# EAGLE design AudioHacker_v1.2 (EAGLE 6.4)
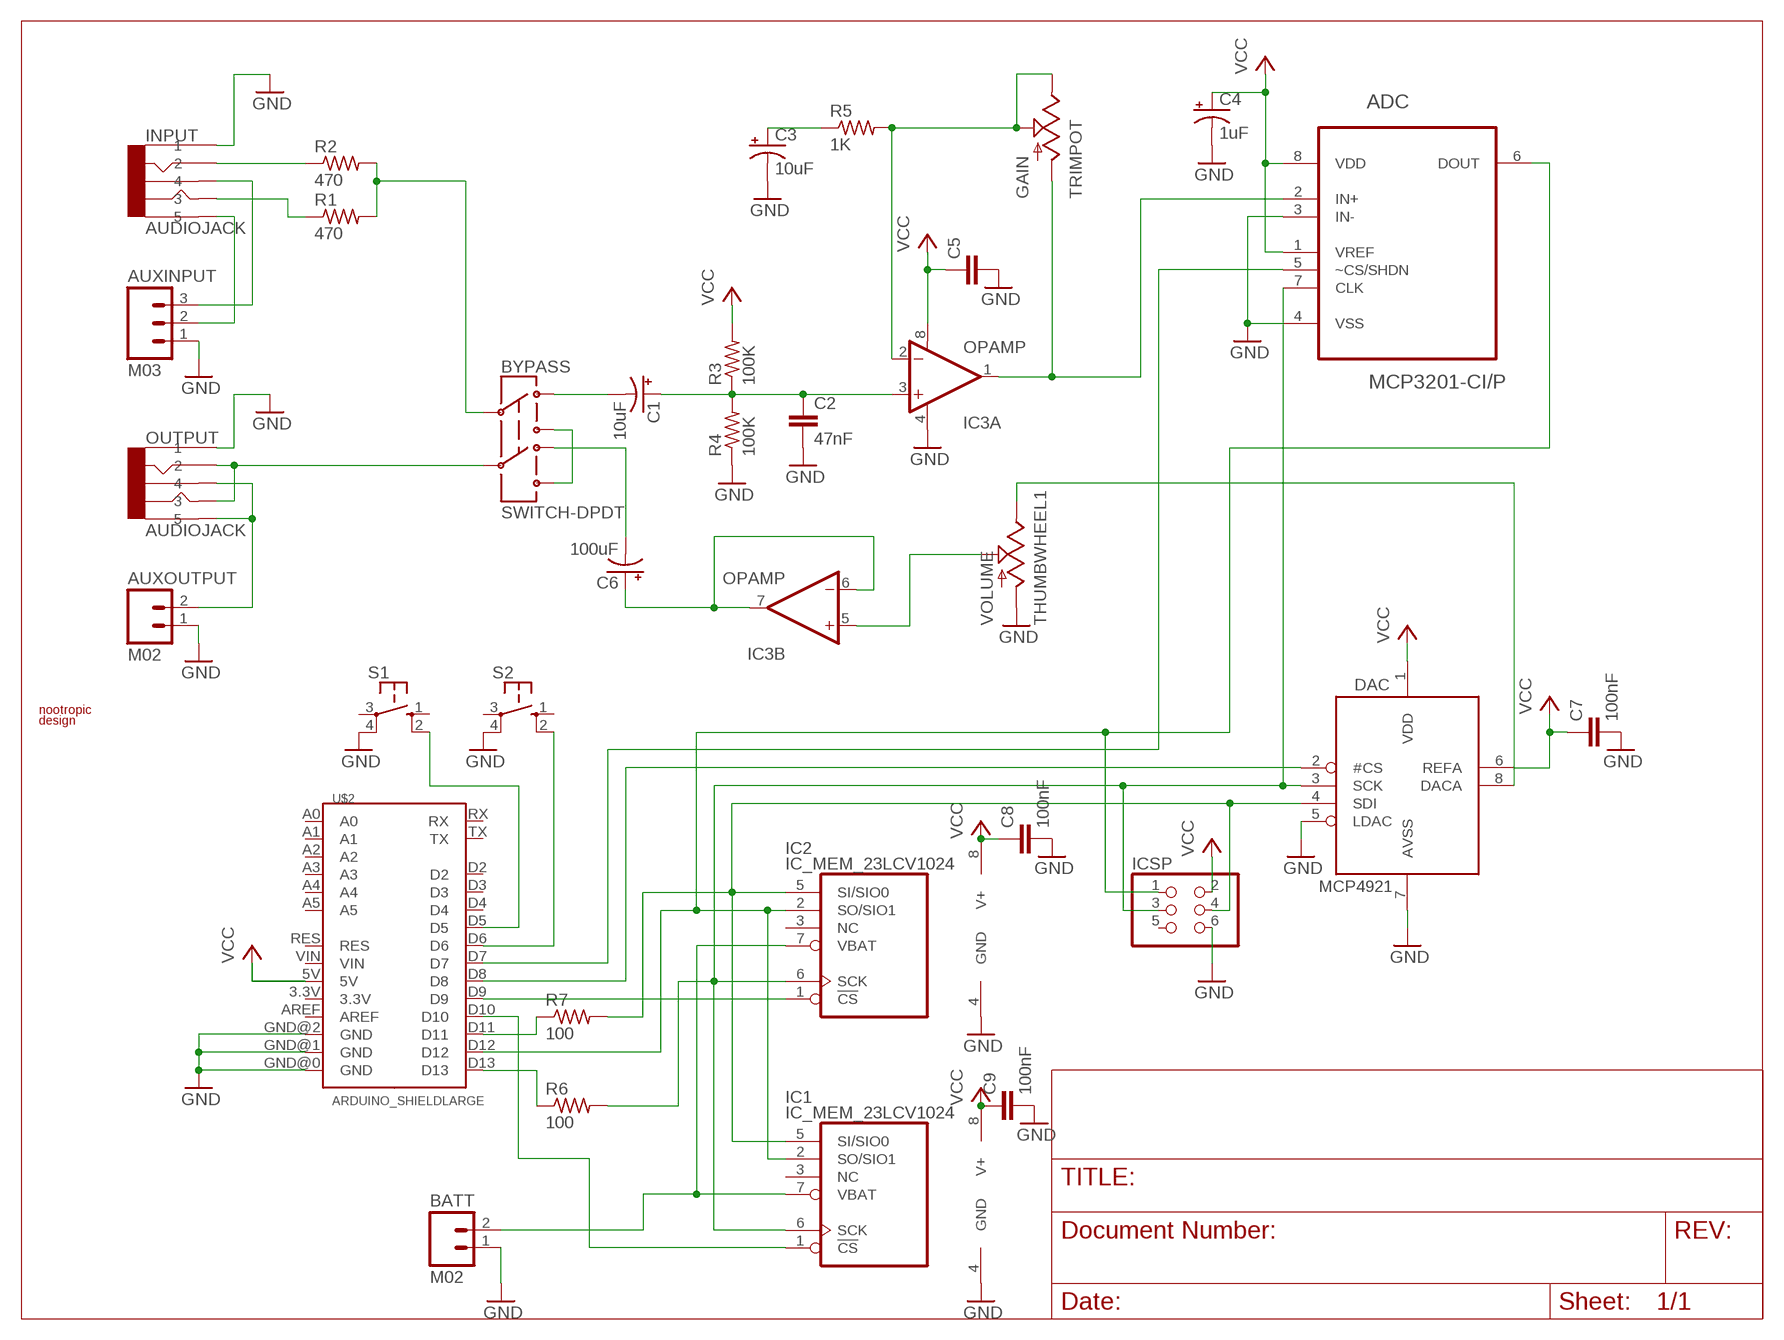
[diagram p0: schematic, sheet 1]
FRAME1 (LETTER_L): DRAWING_NAME: Audio Hacker

## Parts
ADC  MCP3201-CI/P  [DIL08]
AUXINPUT  M03  [1X03]
AUXOUTPUT  M02  [1X02]
BATT  M02  [1X02]
BYPASS  SWITCH-DPDT  [OS]
C1  10uF  CAP-POL5MM  [E2.5-5]
C2  47nF  CAP  [CAP-CERAMIC]
C3  10uF  CAP-POL5MM  [E2.5-5]
C4  1uF  CAP-POL5MM  [E2.5-5]
C5  CAPSMALL  [CAP-CERAMIC-SMALL]
C6  100uF  CAP-POL6MM  [E2.5-6]
C7  100nF  CAPSMALL  [CAP-CERAMIC-SMALL]
C8  100nF  CAPSMALL  [CAP-CERAMIC-SMALL]
C9  100nF  CAPSMALL  [CAP-CERAMIC-SMALL]
DAC  MCP4921  [DIL08]
GAIN  TRIMPOT  [TRIM_POT]
IC1  IC_MEM_23LCV1024  [DIL08]
IC2  IC_MEM_23LCV1024  [DIL08]
IC3  OPAMP  OPAMP-DUAL  [DIL08]
ICSP  PINHD-2X3  [2X03]
INPUT  AUDIOJACK  [AUDIOJACK]
OUTPUT  AUDIOJACK  [AUDIOJACK]
R1  470  R-US  [0207/10]
R2  470  R-US  [0207/10]
R3  100K  R-US  [0207/10]
R4  100K  R-US  [0207/10]
R5  1K  R-US  [0207/10]
R6  100  R-US  [0207/10]
R7  100  R-US  [0207/10]
S1  SWITCH-TACTSWITCH-TACT-B  [SWITCH-TACT-B]
S2  SWITCH-TACTSWITCH-TACT-B  [SWITCH-TACT-B]
U$2  ARDUINO_SHIELDLARGE  [DUEMILANOVE_SHIELD_LARGE]
U$3  LOGO  [LOGO_SMALL]
VOLUME  THUMBWHEEL1  [THUMBWHEEL1]

## Nets
AMP_OUT: C6.+ IC3.6(B:-IN) IC3.7(B:OUT)
DAC_OUT: DAC.8(DACA) VOLUME.P$3
DAC_OUT2: IC3.5(B:+IN) VOLUME.P$2
GND: ADC.3(IN-) ADC.4(VSS) AUXINPUT.1 AUXOUTPUT.1 BATT.1 C2.2 C3.- C4.- C5.2 C7.2 C8.2 C9.2 DAC.5(LDAC) DAC.7(AVSS) IC1.4(GND) IC2.4(GND) IC3.4(A:V-) ICSP.6 INPUT.1 OUTPUT.1 R4.1 S1.4(P1) S2.4(P1) U$2.GND@0(GND) U$2.GND@1(GND) U$2.GND@2(GND) VOLUME.P$1
INPUT: BYPASS.2 R1.2 R2.2
MISO: ADC.6(DOUT) IC1.2(SO/SIO1) IC2.2(SO/SIO1) ICSP.1 U$2.D12
MOSI: DAC.4(SDI) IC1.5(SI/SIO0) IC2.5(SI/SIO0) ICSP.4 R7.2
MOSIPIN: R7.1 U$2.D11
N$1: AUXINPUT.3 INPUT.4
N$2: AUXINPUT.2 INPUT.5
N$4: AUXOUTPUT.2 OUTPUT.4 OUTPUT.5
N$5: BYPASS.3 BYPASS.6
N$6: INPUT.2 R2.1
N$7: INPUT.3 R1.1
N$8: GAIN.2 GAIN.3 IC3.2(A:-IN) R5.2
N$9: ADC.2(IN+) GAIN.1 IC3.1(A:OUT)
N$11: C3.+ R5.1
N$12: BYPASS.1 C1.-
N$13: C1.+ C2.1 IC3.3(A:+IN) R3.1 R4.2
N$14: BYPASS.4 C6.-
N$18: R6.1 U$2.D13
N$20: ADC.5(~CS/SHDN) U$2.D7
N$21: DAC.2(#CS) U$2.D8
N$22: S2.2(S1) U$2.D6
N$23: IC1.1(!CS) U$2.D10
N$24: IC2.1(!CS) U$2.D9
N$25: S1.2(S1) U$2.D5
OUTPUT: BYPASS.5 OUTPUT.2 OUTPUT.3
SCK: ADC.7(CLK) DAC.3(SCK) IC1.6(SCK) IC2.6(SCK) ICSP.3 R6.2
VBAT: BATT.2 IC1.7(VBAT) IC2.7(VBAT)
VCC: ADC.1(VREF) ADC.8(VDD) C4.+ C5.1 C7.1 C8.1 C9.1 DAC.1(VDD) DAC.6(REFA) IC1.8(V+) IC2.8(V+) IC3.8(A:V+) ICSP.2 R3.2 U$2.5V
Unconnected: IC1.3(NC) IC2.3(NC) ICSP.5 S1.1(S) S1.3(P) S2.1(S) S2.3(P) U$2.3.3V U$2.A0 U$2.A1 U$2.A2 U$2.A3 U$2.A4 U$2.A5 U$2.AREF U$2.D2 U$2.D3 U$2.D4 U$2.RES U$2.RX U$2.TX U$2.VIN

## Library data of the parts
ADC = nootropicdesign:MCP3201-CI/P: A/D Converter
AUXINPUT = nootropicdesign:M03
AUXOUTPUT BATT = nootropicdesign:M02: 2-pin header
BYPASS = nootropicdesign:SWITCH-DPDT: DPDT Version of the COM-00597
C1 C3 C4 C6 = nootropicdesign:CAP-POL: Capacitor - Polarized, Electrolytic
C2 C5 C7-C9 = nootropicdesign:CAP: Unpolarized capacitor
DAC = adafruit:MCP4921
GAIN = nootropicdesign:TRIMPOT
IC1 IC2 = nootropicdesign:IC_MEM_23LCV1024: 1Mbit SPI SRAM
IC3 = nootropicdesign:OPAMP-DUAL: Generic op-amp footprint
ICSP = pinhead:PINHD-2X3: PIN HEADER
INPUT OUTPUT = nootropicdesign:AUDIOJACK
R1-R7 = nootropicdesign:R-US: Resistor
S1 S2 = nootropicdesign:SWITCH-TACT: 12MM Tactile Switch
U$2 = nootropicdesign:ARDUINO_SHIELD
U$3 = nootropicdesign:LOGO
VOLUME = nootropicdesign:THUMBWHEEL1

## Board
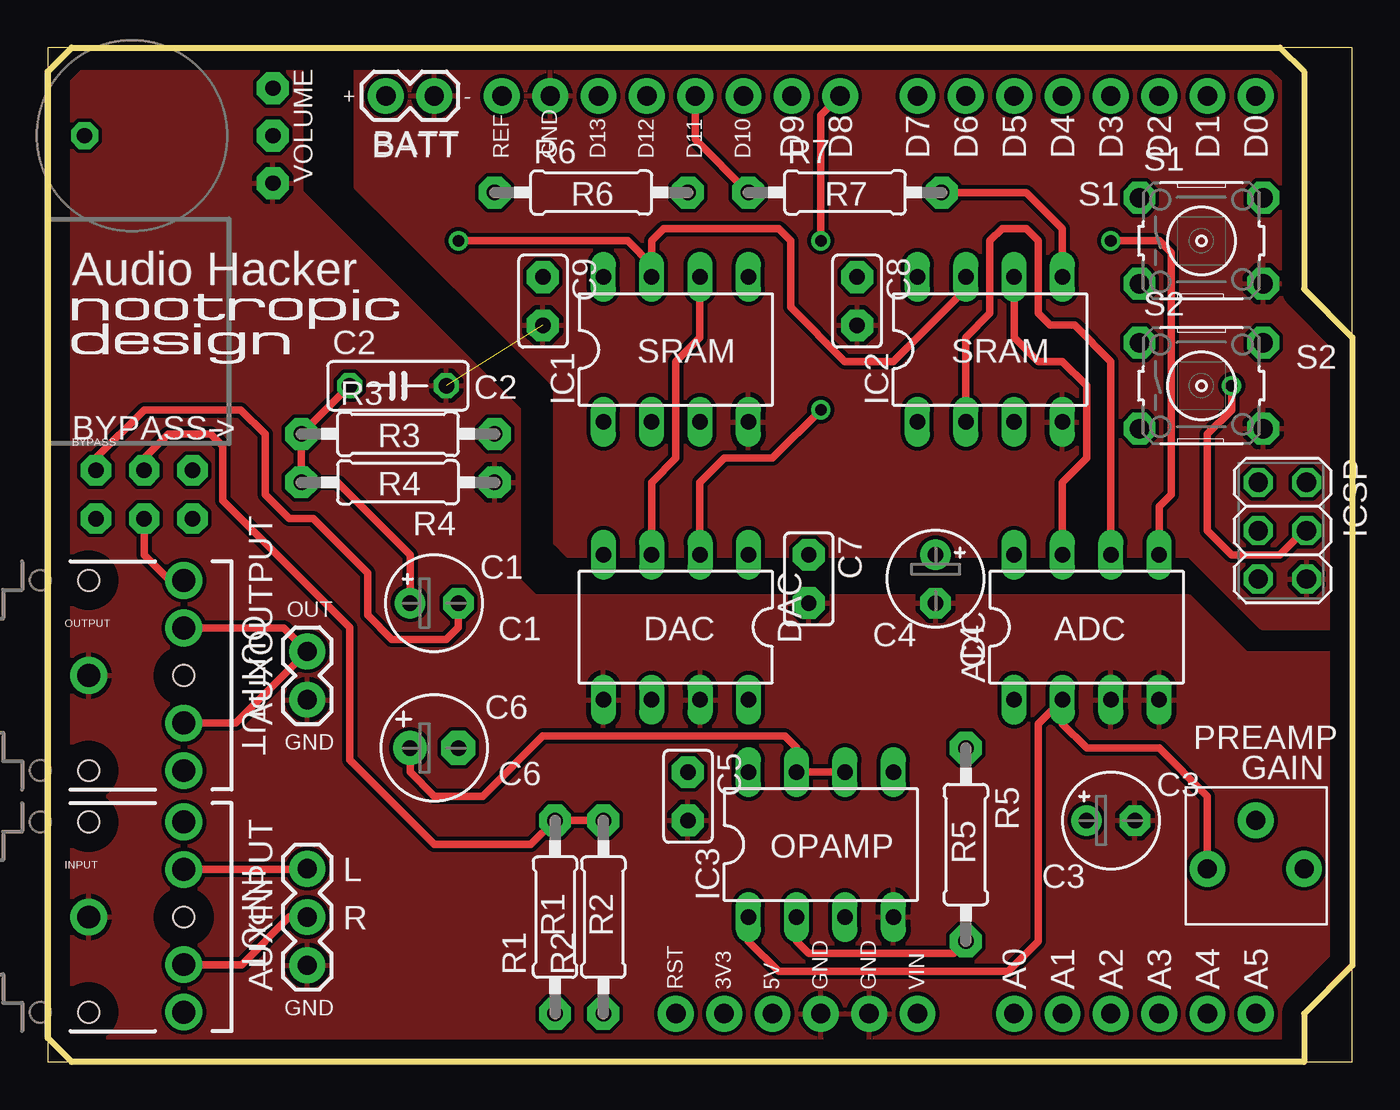
[diagram p1: board, top side]
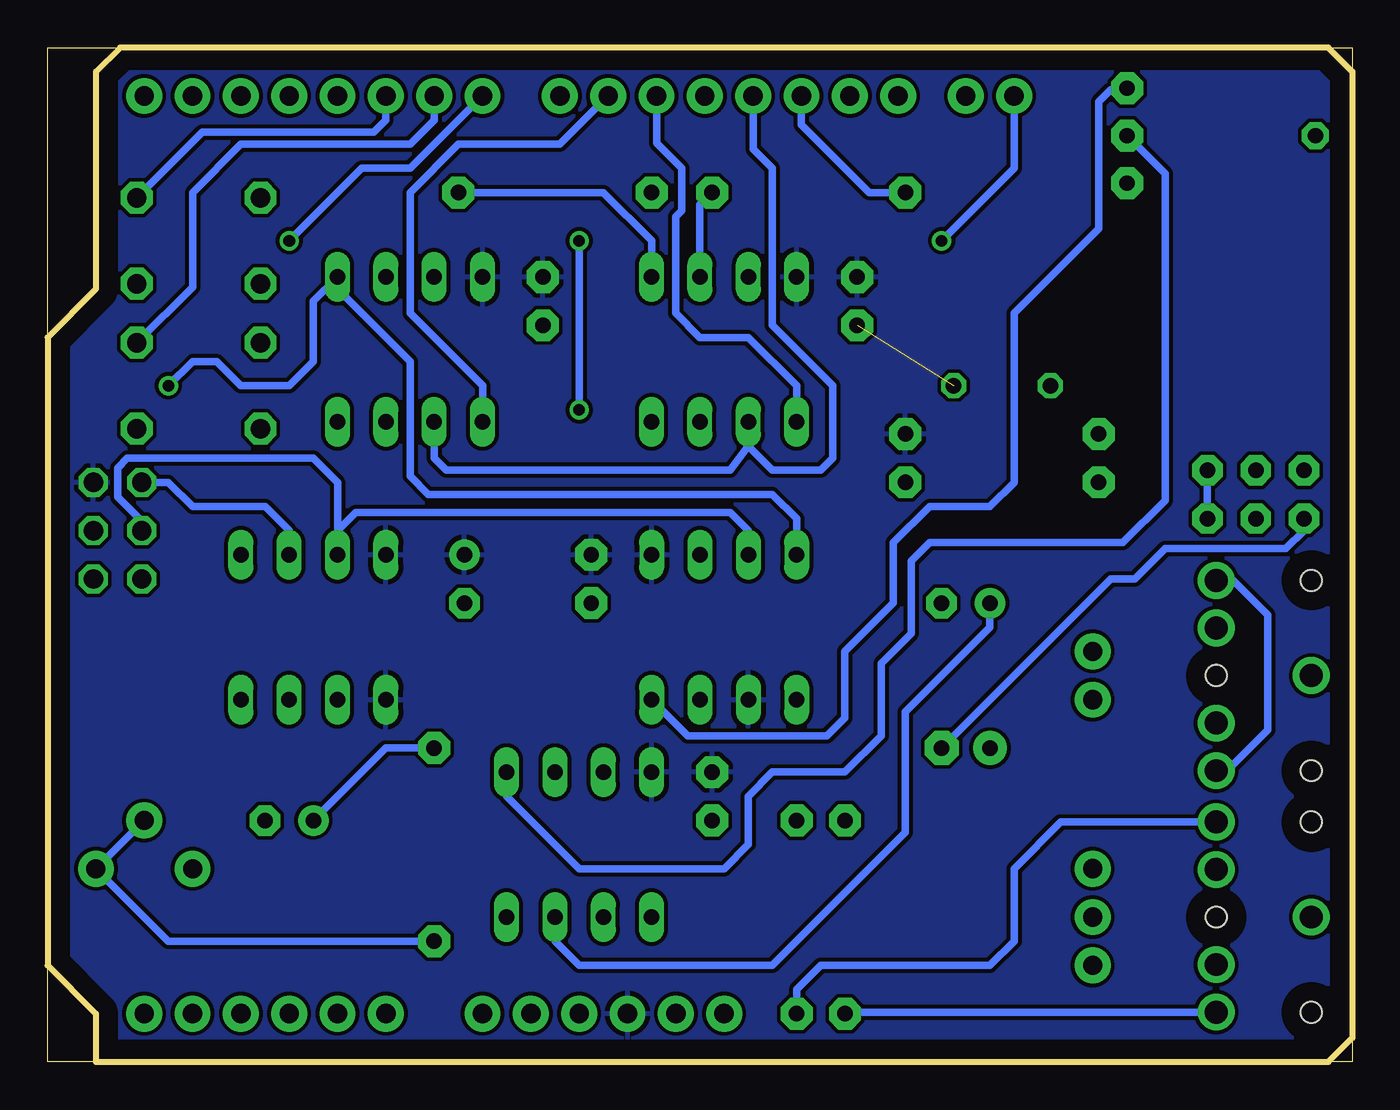
[diagram p2: board, bottom side, seen from below]

Size 68.58 x 53.34 mm. Coordinates in mm from the lower left corner, seen from the top.
Outline: 0,0 68.58,0 68.58,53.34 0,53.34 0,0
Copper layers (1*16): Top 0.035mm / dielectric 1.5mm / Bottom 0.035mm
Design rules "default *": minimum track width 10mil, minimum drill 24mil, track to track 8mil, track to pad 13mil, pad to pad 8mil, via to via 8mil, smd to smd 8mil, copper to edge 40mil, drill to drill 8mil, minimum pad ring 10mil, minimum via ring 8mil, stop-mask expansion 4mil, vias tented up to drill 0mil, thermal gap 10mil

### Footprints (pad centres in the part's own frame; a part is rotated, then mirrored left to right if it is on the bottom)
DIL08 = drill 0.813 long: 1 -3.81,-3.81; 2 -1.27,-3.81; 3 1.27,-3.81; 4 3.81,-3.81; 5 3.81,3.81; 6 1.27,3.81; 7 -1.27,3.81; 8 -3.81,3.81
1X03 = drill 1.016 pad 1.88: 1 -2.54,0; 2 0,0; 3 2.54,0
1X02 = drill 1.016 pad 1.88: 1 0,0; 2 2.54,0
OS = drill 0.813 pad 1.6 octagon: 1 -2.54,1.27; 2 0,1.27; 3 2.54,1.27; 4 -2.54,-1.27; 5 0,-1.27; 6 2.54,-1.27
E2.5-5 = drill 0.813 pad 1.6: + -1.27,0 | drill 0.813 pad 1.6 octagon: - 1.27,0
CAP-CERAMIC = drill 0.813 octagon: 1 -2.54,0; 2 2.54,0
CAP-CERAMIC-SMALL = drill 0.813 pad 1.676 octagon: 1 -1.27,0; 2 1.27,0
E2.5-6 = drill 0.813 pad 1.778: + -1.27,0 | drill 0.813 pad 1.778 octagon: - 1.27,0
TRIM_POT = drill 1 pad 1.88: 1 0,2.54; 2 2.54,0; 3 0,-2.54
2X03 = drill 1.016 octagon: 1 -2.54,-1.27; 2 -2.54,1.27; 3 0,-1.27; 4 0,1.27; 5 2.54,-1.27; 6 2.54,1.27
AUDIOJACK = drill 1.2 pad 1.93: 1 0,0; 2 5,5; 3 5,-5; 4 5,2.5; 5 5,-2.5 | hole 1.1: 0,5; 0,-5; 5,0
0207/10 = drill 0.813 pad 1.676 octagon: 1 -5.08,0; 2 5.08,0
SWITCH-TACT-B = drill 1.016 pad 1.676 octagon: 1 -3.251,2.261; 2 3.251,2.261; 3 -3.251,-2.261; 4 3.251,-2.261
DUEMILANOVE_SHIELD_LARGE = drill 1.016 pad 1.88: 3.3V 35.56,2.54; 5V 38.1,2.54; A0 50.8,2.54; A1 53.34,2.54; A2 55.88,2.54; A3 58.42,2.54; A4 60.96,2.54; A5 63.5,2.54; AREF 23.876,50.8; D2 58.42,50.8; D3 55.88,50.8; D4 53.34,50.8; D5 50.8,50.8; D6 48.26,50.8; D7 45.72,50.8; D8 41.656,50.8; D9 39.116,50.8; D10 36.576,50.8; D11 34.036,50.8; D12 31.496,50.8; D13 28.956,50.8; GND@0 40.64,2.54; GND@1 43.18,2.54; GND@2 26.416,50.8; RES 33.02,2.54; RX 63.5,50.8; TX 60.96,50.8; VIN 45.72,2.54
THUMBWHEEL1 = drill 0.8 pad 1.422 octagon: P$0 0,2.5 | drill 0.8 pad 1.676 octagon: P$1 -2.5,-7.4; P$2 0,-7.4; P$3 2.5,-7.4

### Placement (x,y rotation side)
ADC  54.61,22.86 0 top
AUXINPUT  13.65,7.62 90 top
AUXOUTPUT  13.65,19.05 90 top
BATT  20.32,50.8 180 top
BYPASS  5.08,29.84 0 top
C1  20.32,24.13 0 top
C2  18.41,35.56 0 top
C3  55.88,12.7 0 top
C4  46.67,25.4 270 top
C5  33.66,13.97 270 top
C6  20.32,16.51 0 top
C7  40.01,25.4 270 top
C8  42.55,40.01 270 top
C9  26.04,40.01 270 top
DAC  33.02,22.86 180 top
GAIN  63.5,10.16 90 top
IC1  33.02,37.47 0 top
IC2  49.53,37.47 0 top
IC3  40.64,11.43 0 top
ICSP  64.9,27.94 270 top
INPUT  2.16,7.62 0 top
OUTPUT  2.16,20.32 0 top
R1  26.67,7.62 90 top
R2  29.21,7.62 90 top
R3  18.41,33.02 0 top
R4  18.41,30.48 180 top
R5  48.26,11.43 270 top
R6  28.57,45.72 0 top
R7  41.91,45.72 0 top
S1  60.64,43.18 0 top
S2  60.64,35.56 0 top
U$2  0,0 0 top
U$3  1.27,36.7 0 top
VOLUME  4.45,48.7 90 top

### Tracks (layer width: path | path; a pad name or v marks a point on that pad's centre or on a via)
AMP_OUT
  Top 0.406: C6.+ 19.05,15.24 20.32,13.97 22.86,13.97 26.04,17.14 38.73,17.14 39.37,16.51 IC3.7 IC3.6
DAC_OUT
  Bottom 0.406: VOLUME.P$3 11.93,51.12 12.7,51.12 13.34,50.48 13.34,43.81 17.78,39.37 17.78,30.48 19.05,29.21 22.23,29.21 24.13,27.3 24.13,24.13 26.67,21.59 26.67,18.1 27.62,17.14 34.92,17.14 DAC.8
DAC_OUT2
  Bottom 0.406: VOLUME.P$2 9.84,46.7 9.84,29.53 12.06,27.3 22.23,27.3 23.18,26.35 23.18,22.54 24.77,20.95 24.77,17.14 26.67,15.24 30.48,15.24 31.75,13.97 31.75,11.43 33.02,10.16 40.64,10.16 44.45,13.97 IC3.5
GND  (1 unrouted)
  pour Top: 27.3,26.67 60.01,26.67 63.82,22.86 68.2,22.86 68.2,37.97 65.66,40.51 65.66,51.94 64.64,52.96 16.19,52.96 16.19,46.04 26.67,35.56 26.67,27.3
  pour Top: 13.34,52.96 1.52,52.96 0.38,51.82 0.38,1.52 1.52,0.38 65.66,0.38 65.66,2.79 68.2,5.33 68.2,21.46 62.99,21.46 60.01,24.45 29.21,24.45 26.54,24.44 25.64,24.44 24.77,25.32 24.77,34.29 13.34,45.72
INPUT
  Top 0.406: BYPASS.2 5.08,31.75 6.35,33.02 8.57,33.02 9.21,32.38 9.21,29.53 15.88,22.86 15.88,15.88 20.32,11.43 25.4,11.43 R1.2 R2.2
MISO
  Top 0.406: IC2.2 48.26,38.1 49.53,39.37 49.53,43.18 50.16,43.81 51.44,43.81 52.07,43.18 52.07,39.37 52.7,38.73 53.98,38.73 55.88,36.83 ADC.6
  Bottom 0.406: 31.75,32.38 32.7,31.11 47.62,31.11 48.26,31.75 IC2.2 | IC1.2 31.75,32.38 | ICSP.1 62.23,30.48 60.96,29.21 57.15,29.21 55.88,27.94 ADC.6 | U$2.D12 31.5,48.01 30.48,46.99 30.48,38.73 27.3,35.56 27.3,31.75 27.94,31.11 30.48,31.11 31.75,32.38
MOSI  (via drill 0.61)
  Top 0.406: R7.2 51.44,45.72 53.34,43.81 IC2.5 | ICSP.4 66.04,27.94 64.77,26.67 62.23,26.67 60.96,27.94 60.96,33.02 62.23,34.29 v62.23,35.56
  Bottom 0.406: R7.2 39.37,45.72 36.83,43.18 IC1.5 | DAC.4 29.21,28.57 30.48,29.84 48.58,29.84 49.53,30.8 49.53,36.83 53.34,40.64 IC2.5 54.61,40.01 54.61,36.83 55.88,35.56 58.42,35.56 59.69,36.83 60.96,36.83 v62.23,35.56
MOSIPIN
  Top 0.406: U$2.D11 34.04,48.51 R7.1
N$1
  Top 0.406: INPUT.4 13.61,10.12 AUXINPUT.3
N$2
  Top 0.406: INPUT.5 10.2,5.12 12.7,7.62 AUXINPUT.2
N$4
  Top 0.406: OUTPUT.4 12.42,22.82 AUXOUTPUT.2 9.88,17.82 OUTPUT.5
N$5
  Bottom 0.406: BYPASS.3 BYPASS.6
N$6
  Bottom 0.406: INPUT.2 15.32,12.62 17.78,10.16 17.78,6.35 19.05,5.08 27.94,5.08 29.21,3.81 R2.1
N$7
  Bottom 0.406: INPUT.3 26.59,2.62 R1.1
N$8
  Top 0.406: IC3.2 39.37,6.35 40.01,5.71 47.62,5.71 R5.2
  Bottom 0.406: R5.2 62.23,6.35 GAIN.3 GAIN.2
N$9
  Top 0.406: IC3.1 36.83,6.35 38.42,4.76 50.48,4.76 52.07,6.35 52.07,17.78 ADC.2 53.34,17.78 54.61,16.51 58.42,16.51 60.96,13.97 GAIN.1
N$11
  Bottom 0.406: R5.1 50.8,16.51 C3.+
N$12
  Top 0.406: C1.- 21.59,22.86 20.95,22.23 18.1,22.23 16.83,23.5 16.83,25.72 13.97,28.57 12.7,28.57 11.43,29.84 11.43,33.02 10.16,34.29 5.08,34.29 2.54,31.75 BYPASS.1
N$13
  Top 0.406: C2.1 R3.1 R4.2 15.24,30.48 19.05,26.67 C1.+
  Bottom 0.406: C1.+ 19.05,22.86 23.5,18.41 23.5,12.06 30.48,5.08 40.64,5.08 41.91,6.35 IC3.3
N$14
  Bottom 0.406: BYPASS.4 2.54,27.94 3.49,26.99 9.84,26.99 11.43,25.4 12.7,25.4 C6.-
N$18
  Bottom 0.406: U$2.D13 28.96,49.28 25.4,45.72 R6.1
N$20  (via drill 0.61 pad 0.61)
  Top 0.406: ADC.5 58.42,29.21 59.05,29.84 59.05,42.55 58.42,43.18 v55.88,43.18
  Bottom 0.406: U$2.D7 49.53,46.99 52.07,46.99 v55.88,43.18
N$21  (via drill 0.61 pad 0.61)
  Top 0.406: DAC.2 34.29,30.48 35.56,31.75 38.1,31.75 v40.64,34.29 | U$2.D8 40.64,49.78 v40.64,43.18
  Bottom 0.406: v40.64,34.29 v40.64,43.18
N$22
  Bottom 0.406: U$2.D6 48.26,49.53 49.53,48.26 58.42,48.26 60.96,45.72 60.96,40.75 S2.2
N$23
  Bottom 0.406: U$2.D10 36.58,48.32 35.24,46.99 35.24,44.77 35.56,44.45 35.56,39.37 34.29,38.1 31.75,38.1 29.21,35.56 IC1.1
N$24
  Bottom 0.406: IC2.1 45.72,35.56 49.53,39.37 49.53,45.72 46.99,48.26 41.66,48.26 U$2.D9
N$25
  Bottom 0.406: U$2.D5 50.8,49.53 51.44,48.9 60.44,48.9 S1.2
OUTPUT
  Top 0.406: BYPASS.5 5.08,26.67 6.43,25.32 OUTPUT.2
  Bottom 0.406: OUTPUT.3 6.59,15.32 4.45,17.46 4.45,23.5 6.35,25.4 7.08,25.4 OUTPUT.2
SCK
  Top 0.406: IC1.6 34.29,38.1 33.02,36.83 33.02,31.75 31.75,30.48 DAC.3 | IC2.6 50.8,38.1 52.07,36.83 53.34,36.83 54.61,35.56 54.61,31.75 53.34,30.48 ADC.7
  Bottom 0.406: ICSP.3 63.63,28.45 64.9,29.72 64.9,31.24 64.39,31.75 54.61,31.75 53.34,30.48 53.34,27.94 | IC1.6 34.29,45.09 R6.2 | 53.34,27.94 52.39,28.89 32.7,28.89 31.75,27.94 DAC.3 | 53.34,27.94 ADC.7
VBAT  (via drill 0.61)
  Top 0.406: IC2.7 48.26,40.64 44.45,36.83 41.91,36.83 39.05,39.69 39.05,43.18 38.42,43.81 32.38,43.81 31.75,43.18 31.75,41.91 | IC1.7 31.75,41.91 | 31.75,41.91 30.48,43.18 v21.59,43.18
  Bottom 0.406: v21.59,43.18 17.78,46.99 BATT.2
VCC
  pour Bottom: 1.4,0.38 0.38,1.4 0.38,51.94 1.4,52.96 64.64,52.96 65.66,51.94 65.66,40.51 68.2,37.97 68.2,5.21 65.66,2.67 65.66,0.38

### Text on the board
tPlace: + | - | BATT | VOLUME | R6 | R7 | S1 | Audio Hacker | SRAM | SRAM | S2 | C2 | BYPASS- | - | > | R3 | R4 | OUTPUT | OUT | C1 | DAC | C4 | ADC | GND | PREAMP | C6 | GAIN | OPAMP | INPUT | R5 | L | C3 | R | R1 | R2 | GND